# Altium schematic sheet Sheet1.SchDoc
size A4; SheetNumber: 1; SheetTotal: 1
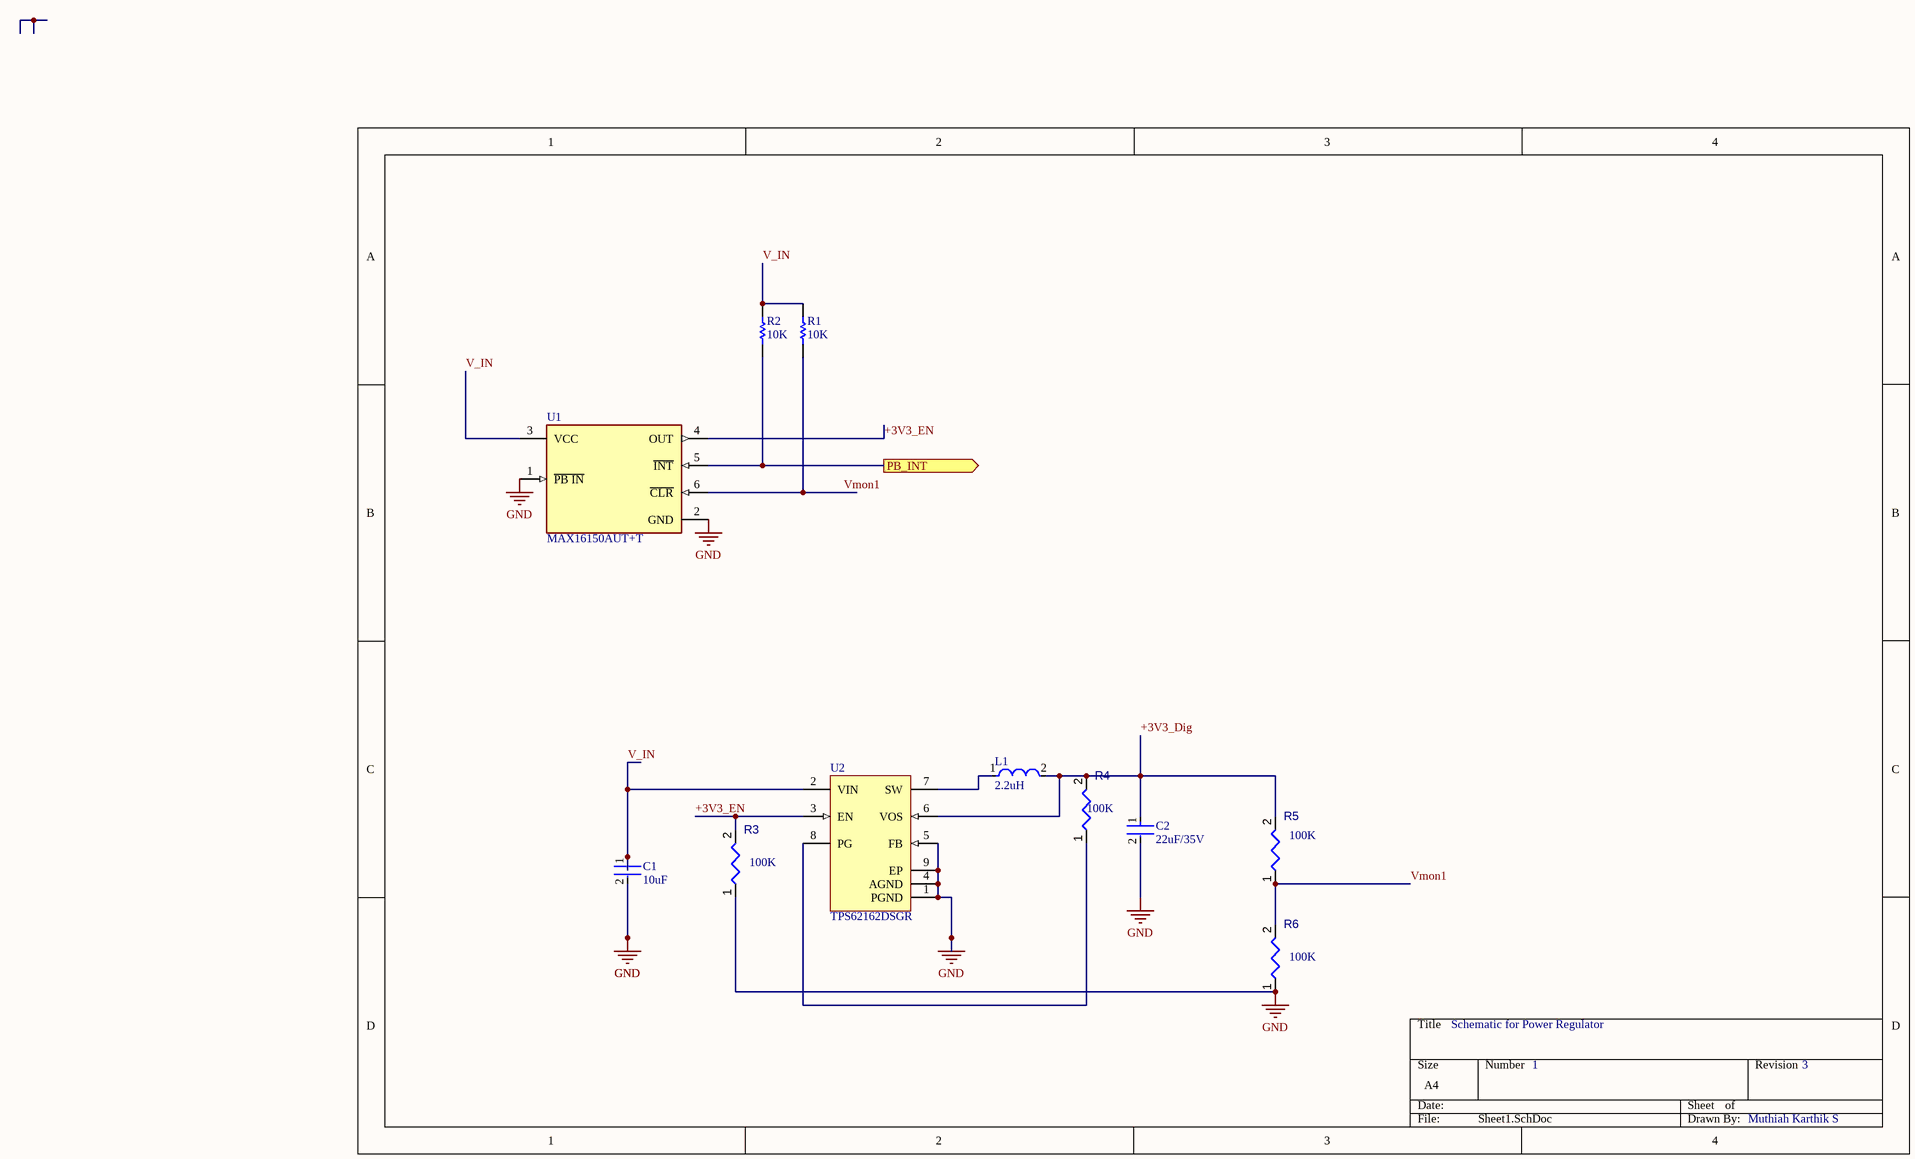
[diagram p0: Sheet1.SchDoc]

## Parts
C1  10uF  [FP-CL21-IPC_C]
C2  22uF/35V  [FP-CL21-IPC_C]
L1  2.2uH  [FP-LQW15AN_00-W0_6-0_1-MFG]
R1  10K  [RESC2013X60X35NL10T20]
R2  10K  [RESC2013X60X35NL10T20]
R3  value 100K  [RESC2013X50X35ML15T15]
R4  value 100K  [RESC2013X50X35ML15T15]
R5  value 100K  [RESC2013X50X35ML15T15]
R6  value 100K  [RESC2013X50X35ML15T15]  (hidden comment: Resistor 10k +/-1% 0805 125 mW)
U1  MAX16150AUT+T  [FP-U6-1-MFG]
U2  TPS62162DSGR  [DSG0008A_V]

## Ports
PB_INT (out)

## Nets
GND: C1.2 C2.2 R3.1 R6.1 U1.1(~{PB_IN}) U1.2(GND) U2.1(PGND) U2.4(AGND) U2.5(FB) U2.9(EP)
+3V3_Dig: C2.1 L1.2 R4.2 R5.2 U2.6(VOS)
+3V3_EN: R3.2 U1.4(OUT) U2.3(EN)
PB_INT: R2.1 U1.5(~{INT}) ; port PB_INT
V_IN: C1.1 R1.2 R2.2 U1.3(VCC) U2.2(VIN)
Vmon1: R1.1 R5.1 R6.2 U1.6(~{CLR})
NetL1_1: L1.1 U2.7(SW)
NetR4_1: R4.1 U2.8(PG)

## Notes on the sheet
- Schematic for Power Regulator
- 1
- 3
- Muthiah Karthik S

## Library data of the parts
C1 C2 = CMP-13271-001271-1: CL21 Series 0805 150nF 25V ±10% Tolerance X7R Multilayer Ceramic Chip Capacitor; Case Code (Metric): 2012; Width: 0.049inch; Thickness: 0.053inch; Dielectric: X7R; Mount: Surface Mount; Capacitance: 150nF; Case Code (Imperial): 0805; Height: 1.25mm; Voltage Rating: 25V; Packaging: Tape and Reel; Max Operating Temperature: 125°C; Length: 2mm; Min Operating Temperature: -55°C; Lead Free: Lead Free; Case/Package: 0805; Package Quantity: 1; Radiation Hardening: No; Tolerance: 10%; Voltage Rating (DC): 25V; Depth: 1.25mm
L1 = CMP-06042-011289-1: Wire Wound RF Inductor 2.9nH ±0.5nH 750mA 0.07Ω 0402 (1005); DC Resistance (DCR): 70mR; Core Material: Non-Magnetic; Shielding: Unshielded; Self Resonant Frequency: 15GHz; Test Frequency: 100MHz; Q Factor: 20; Radiation Hardening: No; DC Current: 750mA; Resistor Type: Wirewound; Case Code (Metric): 1005; Max Operating Temperature: 125°C; Height - Seated (Max): 0.024inch; Case Code (Imperial): 0402; Max DC Current: 750mA; Packaging: Tape and Reel; Width: 0.02inch; Height: 0.5mm; Mount: Surface Mount; Depth: 0.7mm; Weight: 2.8E-05oz; Inductance: 2.9nH; Termination: SMD/SMT; Length: 1mm; Min Operating Temperature: -55°C; Current Rating: 750mA; Military Standard: Not; Package Quantity: 1; Case/Package: 0402
R1 R2 = CMP-1659-00013-4: Chip Resistor, 10 KOhm, +/- 1%, 0.125 W, -55 to 155 degC, 0805 (2012 Metric), RoHS, Tape and Reel; Manufacturer: Yageo; Voltage Rating: 150 V; Mount: Surface Mount; ComponentLink1Description: Manufacturer URL; ComponentLink2URL: http://www.yageo.com/documents/recent/PYu-RC_Group_51_RoHS_L_04.pdf; Pins: 2; Length: 2 mm; Min Operating Temperature: -55 degC; Height: 0.5 mm; Mounting Technology: Surface Mount; RoHSCompliant: true; REACH SVHC: No SVHC; ComponentLink1URL: http://www.yageo.com/; Max Operating Temperature: 155 degC; PackageReference: 0805; DatasheetVersion: Rev. 4, 02/2016; Package Quantity: 5000; Packaging: Tape and Reel; ComponentLink2Description: Datasheet; PackageDescription: 2-Pin Surface Mounted Device, Body 2 x 1.25 mm
R3-R6 = CMP-009-00018-5: Chip Resistor, 10 KOhm, +/- 1%, 125 mW, -55 to 155 degC, 0805 (2012 Metric); Voltage Rating: 150V; Power: 125mW; Tolerance: 1%; Max Operating Temperature: 155°C; Case/Package: 0805; Min Operating Temperature: -55°C; Pins: 2; RoHS Compliant: True; Mounting Technology: SM
U1 = CMP-05723-001129-1: IC SUPERVISOR 1 CHANNEL SOT23-6
U2 = CMP-0323-00316-3: Buck Step Down Regulator with 3 to 17 V Input and 3.3 V Output, -40 to 85 degC, 8-Pin WSON (DSG), Green (RoHS & no Sb/Br); Manufacturer: Texas Instruments; SubFamily: Step-Down Regulator; Synchronous Rectification: TRUE; Vout(Max)(V): 3.3; Regulated Outputs(#): 1; Switch Current Limit(Typ)(A): 1.8; Duty Cycle(Max)(%): 100; Iq(Typ)(mA): 0.017; Rating: Catalog; Vin(Min)(V): 3; Vin(Max)(V): 17; ComponentLink2URL: http://www.ti.com/litv/pdf/mpds308a; ComponentLink3URL: Samples URL:http://www.ti.com/product/tps62162#samples; Eco-Plan: Green (RoHS & no Sb/Br); PackageDescription: 8-Pin Plastic Small Outline No-Lead, 2 x 2 x 0.8 mm Body, 0.5 mm Pitch, Exposed Pad; DatasheetVersion: SLVSAM2A; Topology: Buck; PartNumber: TPS62162DSGR; PackageReference: DSG0008A; ComponentLink1URL: http://www.ti.com/general/docs/lit/getliterature.tsp?genericPartNumber=TPS62162&fileType=pdf; PackageVersion: revB, Oct-2010; Mounting Technology: Surface Mount; Code_JEDEC: MO-229; Iout(Max)(A): 1; ComponentLink1Description: Datasheet; ComponentLink2Description: Package Specification; Vout(Min)(V): 3.3; ComponentLink3Description: URL Link1; Preset Vout(V): 3.3